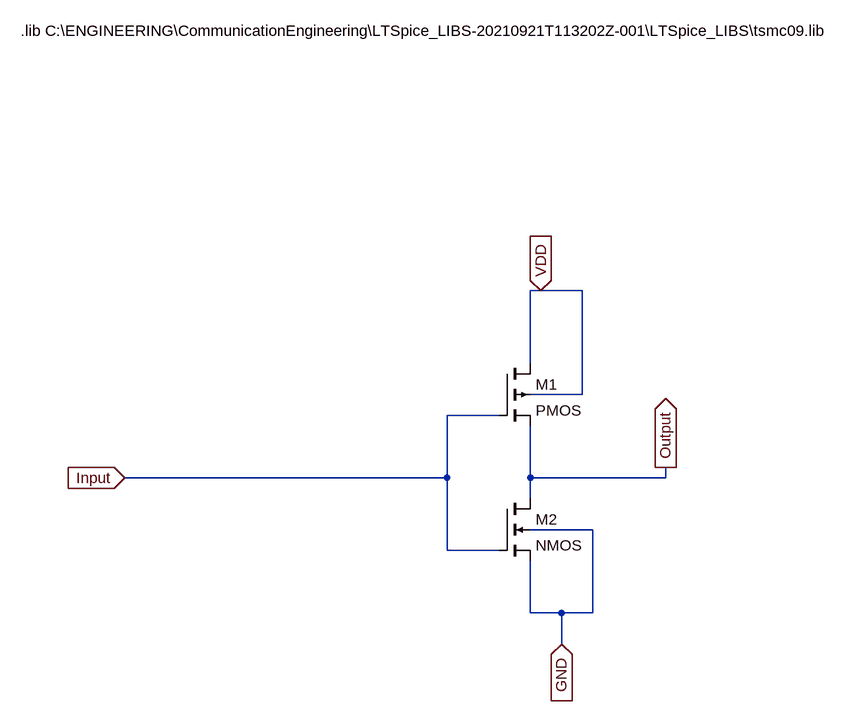
[diagram p0: schematic not_model3EXP.asc]
not_model3EXP.asc, the LTspice schematic file:
Version 4
SHEET 1 888 680
WIRE 240 -96 224 -96
WIRE 304 -96 240 -96
WIRE 224 16 224 -96
WIRE 304 64 304 -96
WIRE 304 64 224 64
WIRE 176 96 96 96
WIRE 96 192 96 96
WIRE 96 192 -400 192
WIRE 224 192 224 112
WIRE 432 192 432 176
WIRE 432 192 224 192
WIRE 224 224 224 192
WIRE 320 272 224 272
WIRE 96 304 96 192
WIRE 176 304 96 304
WIRE 224 400 224 320
WIRE 272 400 224 400
WIRE 320 400 320 272
WIRE 320 400 272 400
WIRE 272 448 272 400
FLAG -400 192 Input
IOPIN -400 192 In
FLAG 432 176 Output
IOPIN 432 176 Out
FLAG 240 -96 VDD
IOPIN 240 -96 In
FLAG 272 448 GND
IOPIN 272 448 In
SYMBOL pmos4 176 16 R0
SYMATTR InstName M1
SYMATTR Value2 l=90n w=440n
SYMBOL nmos4 176 224 R0
SYMATTR InstName M2
SYMATTR Value2 l=90n w=220n
TEXT -560 -496 Left 2 !.lib C:\\ENGINEERING\\CommunicationEngineering\\LTSpice_LIBS-20210921T113202Z-001\\LTSpice_LIBS\\tsmc09.lib

The netlist it stands for:
* not_model3EXP.asc
M1 VDD Input Output VDD PMOS l=90n w=440n
M2 Output Input GND GND NMOS l=90n w=220n
.model NMOS NMOS
.model PMOS PMOS
.lib standard.mos
.lib C:\ENGINEERING\CommunicationEngineering\LTSpice_LIBS-20210921T113202Z-001\LTSpice_LIBS\tsmc09.lib
.backanno
.end